# EAGLE schematic RPi_motor_driver (EAGLE 8.0.2)
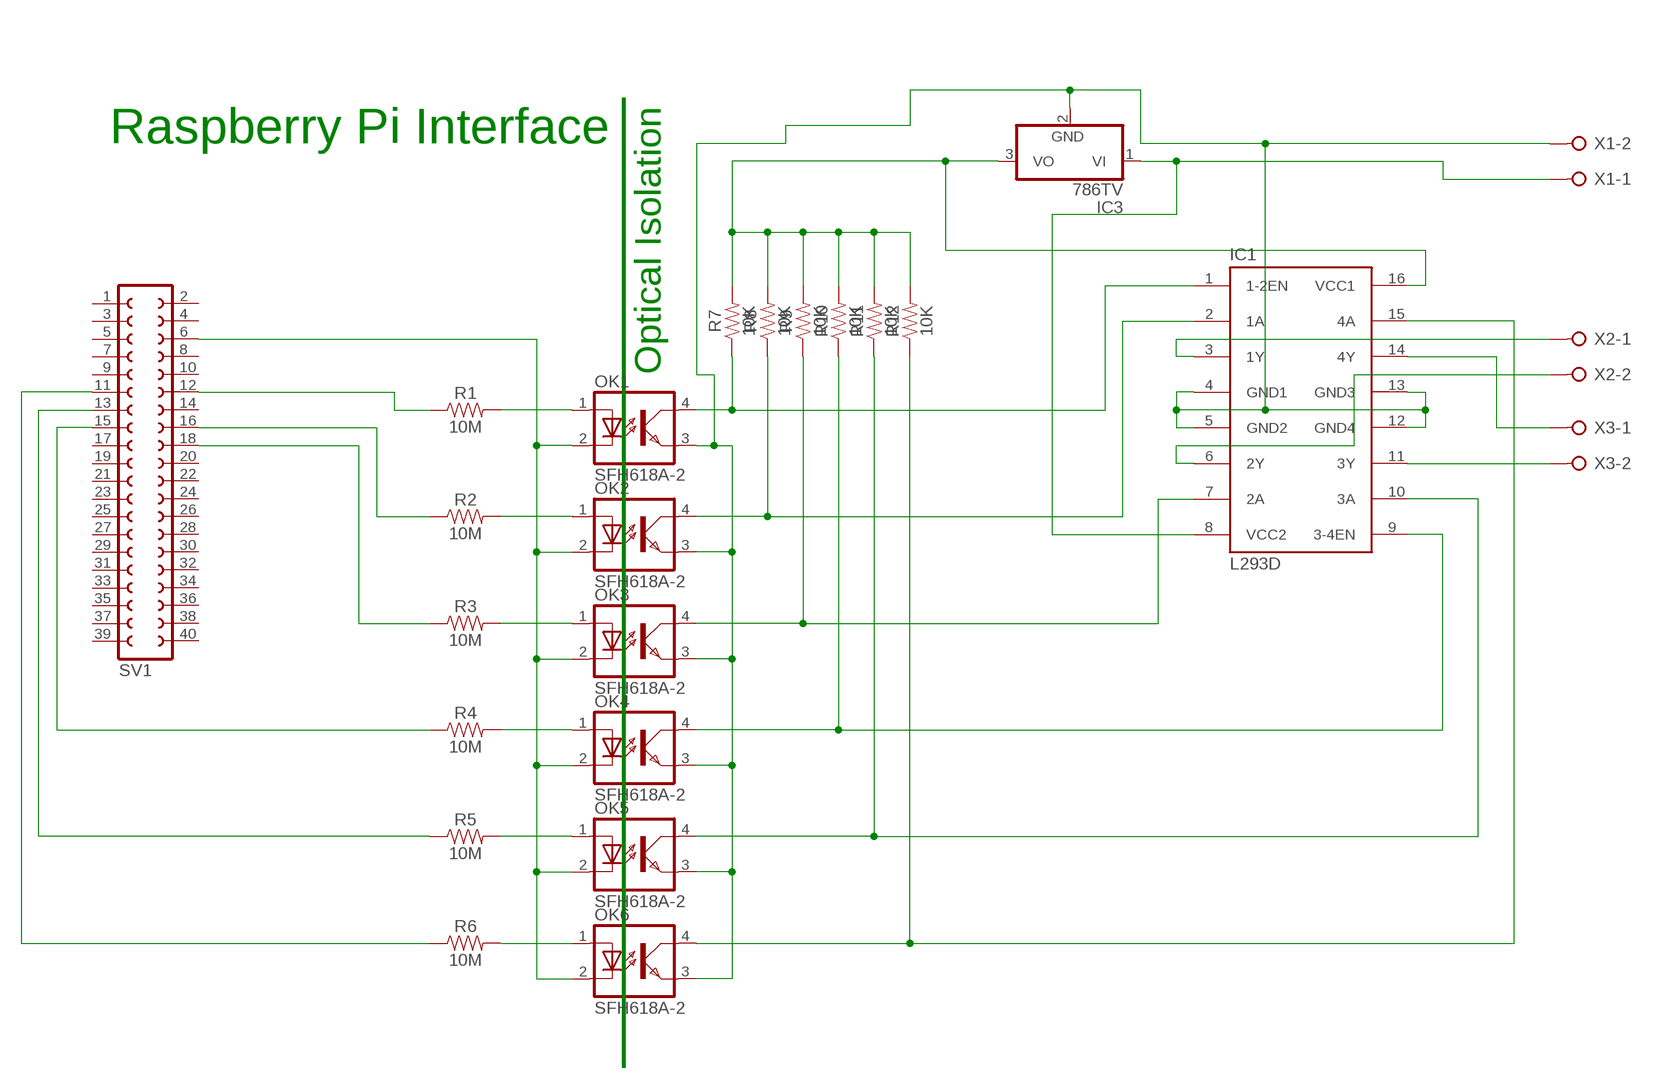
[diagram p0: schematic, sheet 1]

## Parts
IC1  L293D  [DIL16]
IC3  786TV  [TO220V]
OK1  SFH618A-2  [DIP4]
OK2  SFH618A-2  [DIP4]
OK3  SFH618A-2  [DIP4]
OK4  SFH618A-2  [DIP4]
OK5  SFH618A-2  [DIP4]
OK6  SFH618A-2  [DIP4]
R1  10M  10MOHM-HORIZ-1/4W-5%  [AXIAL-0.3]
R2  10M  10MOHM-HORIZ-1/4W-5%  [AXIAL-0.3]
R3  10M  10MOHM-HORIZ-1/4W-5%  [AXIAL-0.3]
R4  10M  10MOHM-HORIZ-1/4W-5%  [AXIAL-0.3]
R5  10M  10MOHM-HORIZ-1/4W-5%  [AXIAL-0.3]
R6  10M  10MOHM-HORIZ-1/4W-5%  [AXIAL-0.3]
R7  10K  10MOHM-HORIZ-1/4W-5%  [AXIAL-0.3]
R8  10K  10MOHM-HORIZ-1/4W-5%  [AXIAL-0.3]
R9  10K  10MOHM-HORIZ-1/4W-5%  [AXIAL-0.3]
R10  10K  10MOHM-HORIZ-1/4W-5%  [AXIAL-0.3]
R11  10K  10MOHM-HORIZ-1/4W-5%  [AXIAL-0.3]
R12  10K  10MOHM-HORIZ-1/4W-5%  [AXIAL-0.3]
SV1  FE20-2  [FE20-2]
X1  W237-02P  [W237-132]
X2  W237-02P  [W237-132]
X3  W237-02P  [W237-132]

## Nets
N$1: IC1.8(VCC2) IC3.1(VI) X1.1
N$2: R1.P$1 SV1.12
N$3: OK1.2(C) OK2.2(C) OK3.2(C) OK4.2(C) OK5.2(C) OK6.2(C) SV1.6
N$4: IC1.16(VCC1) IC3.3(VO) R7.P$2 R8.P$2 R9.P$2 R10.P$2 R11.P$2 R12.P$2
N$5: IC1.1(1-2EN) OK1.4(COL) R7.P$1
N$6: IC1.2(1A) OK2.4(COL) R8.P$1
N$7: IC1.7(2A) OK3.4(COL) R9.P$1
N$8: IC1.9(3-4EN) OK4.4(COL) R10.P$1
N$9: IC1.10(3A) OK5.4(COL) R11.P$1
N$10: IC1.15(4A) OK6.4(COL) R12.P$1
N$12: OK5.1(A) R5.P$2
N$13: OK4.1(A) R4.P$2
N$14: OK3.1(A) R3.P$2
N$15: OK2.1(A) R2.P$2
N$16: OK1.1(A) R1.P$2
N$17: IC1.3(1Y) X2.1
N$18: IC1.14(4Y) X3.1
N$19: IC1.11(3Y) X3.2
N$20: IC1.6(2Y) X2.2
N$25: R2.P$1 SV1.16
N$26: R3.P$1 SV1.18
N$27: R6.P$1 SV1.11
N$28: OK6.1(A) R6.P$2
N$29: R5.P$1 SV1.13
N$30: R4.P$1 SV1.15
N$32: IC1.4(GND1) IC1.5(GND2) IC1.12(GND4) IC1.13(GND3) IC3.2(GND) OK1.3(EMIT) OK2.3(EMIT) OK3.3(EMIT) OK4.3(EMIT) OK5.3(EMIT) OK6.3(EMIT) X1.2
Unconnected: SV1.1 SV1.2 SV1.3 SV1.4 SV1.5 SV1.7 SV1.8 SV1.9 SV1.10 SV1.14 SV1.17 SV1.19 SV1.20 SV1.21 SV1.22 SV1.23 SV1.24 SV1.25 SV1.26 SV1.27 SV1.28 SV1.29 SV1.30 SV1.31 SV1.32 SV1.33 SV1.34 SV1.35 SV1.36 SV1.37 SV1.38 SV1.39 SV1.40

## Notes on the sheet
- Raspberry Pi Interface
- Optical Isolation

## Library data of the parts
IC1 = st-microelectronics:L293D: PUSH-PULL 4 CHANNEL DRIVER; MPN: L293D; OC_FARNELL: 9589619; OC_NEWARK: 56P8249
IC3 = linear:78*: Positive VOLTAGE REGULATOR Source: http://cache.national.com/ds/LM/LM78L05.pdf http://www.fairchildsemi.com/ds/LM/LM7805.pdf
OK1-OK6 = optocoupler:SFH618?*: Optocoupler, Phototransistor Output, Low Input Current Source: Data sheet <http://www.vishay.com/docs/83673/sfh618.pdf>; MF: VISHAY/TELEFUNKEN; MPN: SFH618A-2; OC_FARNELL: 6424855; OC_NEWARK: 21H7744
R1-R6 = SparkFun-Resistors:10MOHM: RES-09327; PROD_ID: RES-09327
R7-R12 = SparkFun-Resistors:10MOHM: RES-09327; PROD_ID: RES-09327; VALUE: 10M
SV1 = con-lsta:FE20-2: FEMALE HEADER; OC_FARNELL: unknown; OC_NEWARK: unknown
X1-X3 = con-wago-508:W237-02P: WAGO SREW CLAMP; OC_FARNELL: unknown; OC_NEWARK: unknown